# EAGLE schematic UV_Pneumatics_H-bridge (EAGLE 6.5.0)
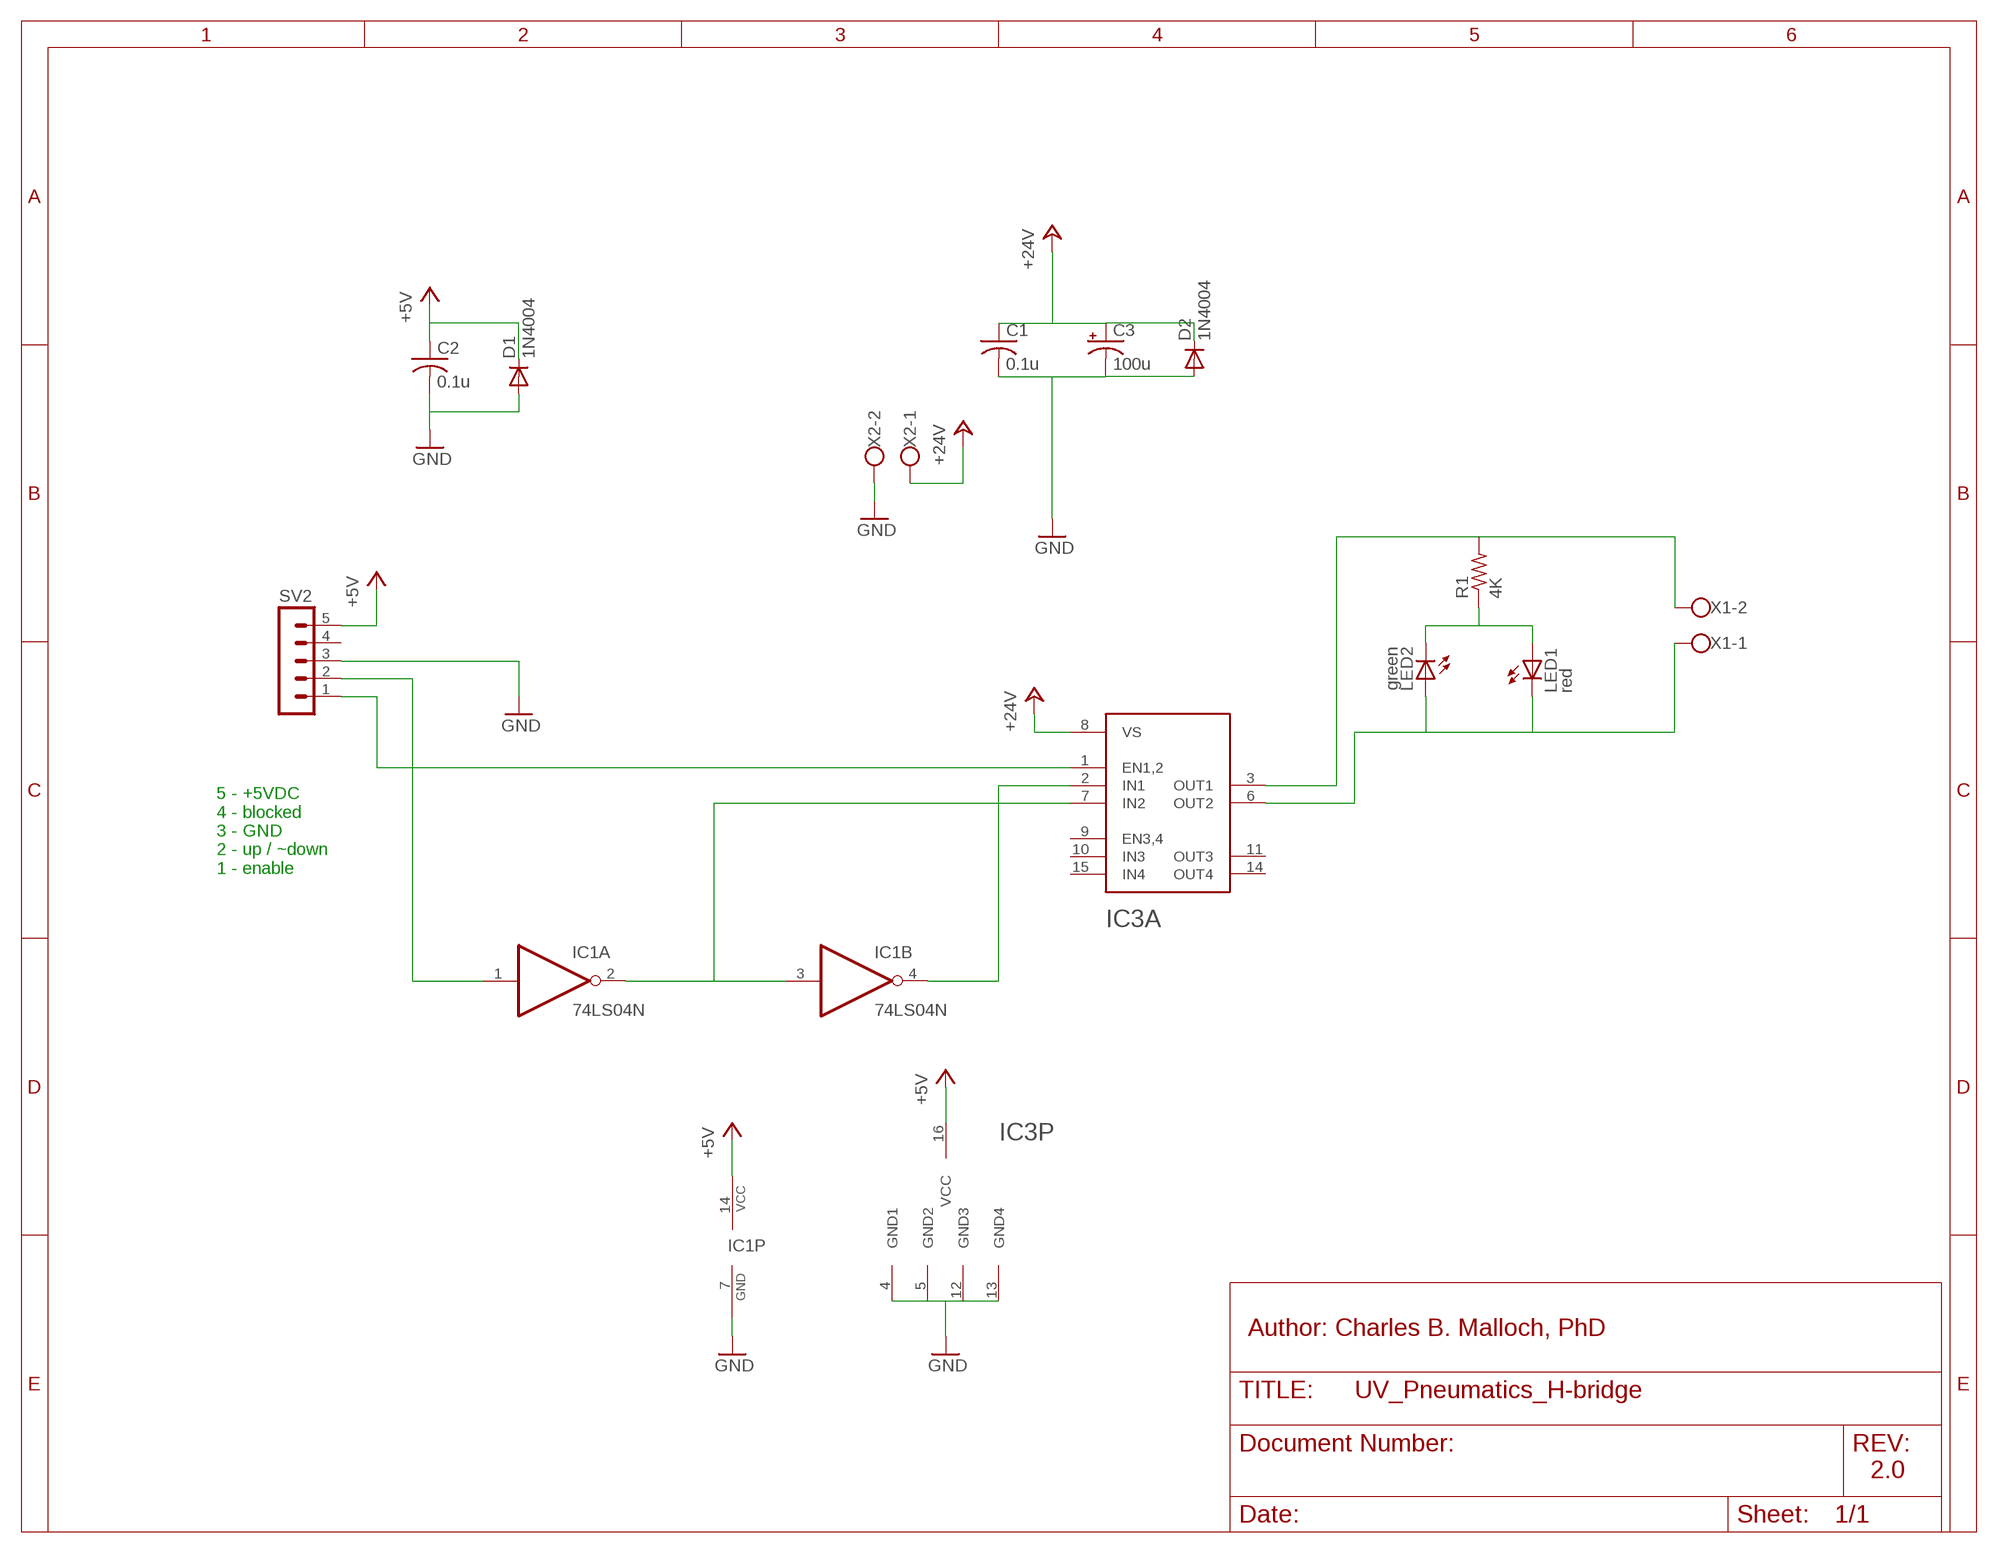
[diagram p0: schematic, sheet 1]

## Parts
C1  0.1u  C-US025-025X050  [C025-025X050]
C2  0.1u  C-US025-025X050  [C025-025X050]
C3  100u  CPOL-USE3.5-10  [E3,5-10]
D1  1N4004  [DO41-10]
D2  1N4004  [DO41-10]
IC1  74LS04N  [DIL14]
IC3  L293D  [DIP16]
LED1  red  LED3MM  [LED3MM]
LED2  green  LED3MM  [LED3MM]
R1  4K  R-US_0207/10  [0207/10]
SV2  MA05-1  [MA05-1]
X1  W237-102  [W237-102]
X2  W237-102  [W237-102]

## Nets
+5V: C2.1 D1.C IC1.14(P:VCC) IC3.16(P:VCC) SV2.5
+24V: C1.1 C3.+ D2.C IC3.8(A:VS) X2.1
GND: C1.2 C2.2 C3.- D1.A D2.A IC1.7(P:GND) IC3.4(P:GND1) IC3.5(P:GND2) IC3.12(P:GND3) IC3.13(P:GND4) SV2.3 X2.2
N$1: IC1.1(A:I) SV2.2
N$2: IC1.2(A:O) IC1.3(B:I) IC3.7(A:IN2)
N$3: IC1.4(B:O) IC3.2(A:IN1)
N$4: IC3.1(A:EN1,2) SV2.1
N$5: LED1.A LED2.K(C) R1.1
N$6: IC3.3(A:OUT1) R1.2 X1.2
N$7: IC3.6(A:OUT2) LED1.K(C) LED2.A X1.1
Unconnected: IC1.5(C:I) IC1.6(C:O) IC1.8(D:O) IC1.9(D:I) IC1.10(E:O) IC1.11(E:I) IC1.12(F:O) IC1.13(F:I) IC3.9(A:EN3,4) IC3.10(A:IN3) IC3.11(A:OUT3) IC3.14(A:OUT4) IC3.15(A:IN4) SV2.4

## Notes on the sheet
- 5 - +5VDC
  4 - blocked
  3 - GND
  2 - up / ~down
  1 - enable
- Author: Charles B. Malloch, PhD
- 2.0

## Library data of the parts
C1 C2 = adafruit:C-US: CAPACITOR, American symbol
C3 = adafruit:CPOL-US: POLARIZED CAPACITOR, American symbol
D1 D2 = diode:1N4004: DIODE general purpose rectifier, 1 A
IC1 = 74xx-us:74*04: Hex INVERTER
IC3 = ads:L293D: L293D Quad Half H-Bridge with integrated diodes
LED1 LED2 = adafruit:LED: LED OSRAM: - CHIPLED LG R971, LG N971, LY N971, LG Q971, LY Q971, LO R971, LY R971 LH N974, LH R974 LS Q976, LO Q976, LY Q976 LO Q996 - Hyper CHIPLED LW Q18S LB Q993, LB Q99A, LB R99A - SideLED LS A670, LO A670, LY A670, LG A670, LP A670 LB A673, LV A673, LT A673, LW A673 LH A674 LY A675 LS A676, LA A676, LO A676, LY A676, LW A676 LS A679, LY A679, LG A679 - Hyper Micro SIDELED® LS Y876, LA Y876, LO Y876, LY Y876 LT Y87S - SmartLED LW L88C, LW L88S LB L89C, LB L89S, LG L890 LS L89K, LO L89K, LY L89K LS L896, LA L896, LO L896, LY L896 - TOPLED LS T670, LO T670, LY T670, LG T670, LP T670 LSG T670, LSP T670, LSY T670, LOP T670, LYG T670 LG T671, LOG T671, LSG T671 LB T673, LV T673, LT T673, LW T673 LH T674 LS T676, LA T676, LO T676, LY T676, LB T676, LH T676, LSB T676, LW T676 LB T67C, LV T67C, LT T67C, LS T67K, LO T67K, LY T67K, LW E67C LS E67B, LA E67B, LO E67B, LY E67B, LB E67C, LV E67C, LT E67C LW T67C LS T679, LY T679, LG T679 LS T770, LO T770, LY T770, LG T770, LP T770 LB T773, LV T773, LT T773, LW T773 LH T774 LS E675, LA E675, LY E675, LS T675 LS T776, LA T776, LO T776, LY T776, LB T776 LHGB T686 LT T68C, LB T68C - Hyper Mini TOPLED® LB M676 - Mini TOPLED Santana® LG M470 LS M47K, LO M47K, LY M47K Source: http://www.osram.convergy.de/
R1 = resistor:R-US_: RESISTOR, American symbol
SV2 = con-lstb:MA05-1: PIN HEADER; OC_FARNELL: unknown; OC_NEWARK: unknown
X1 X2 = con-wago-500:W237-102: WAGO SCREW CLAMP; MPN: 237-102; OC_FARNELL: unknown; OC_NEWARK: 70K9898